# Altium schematic sheet RF_433MHz.SchDoc
size A3
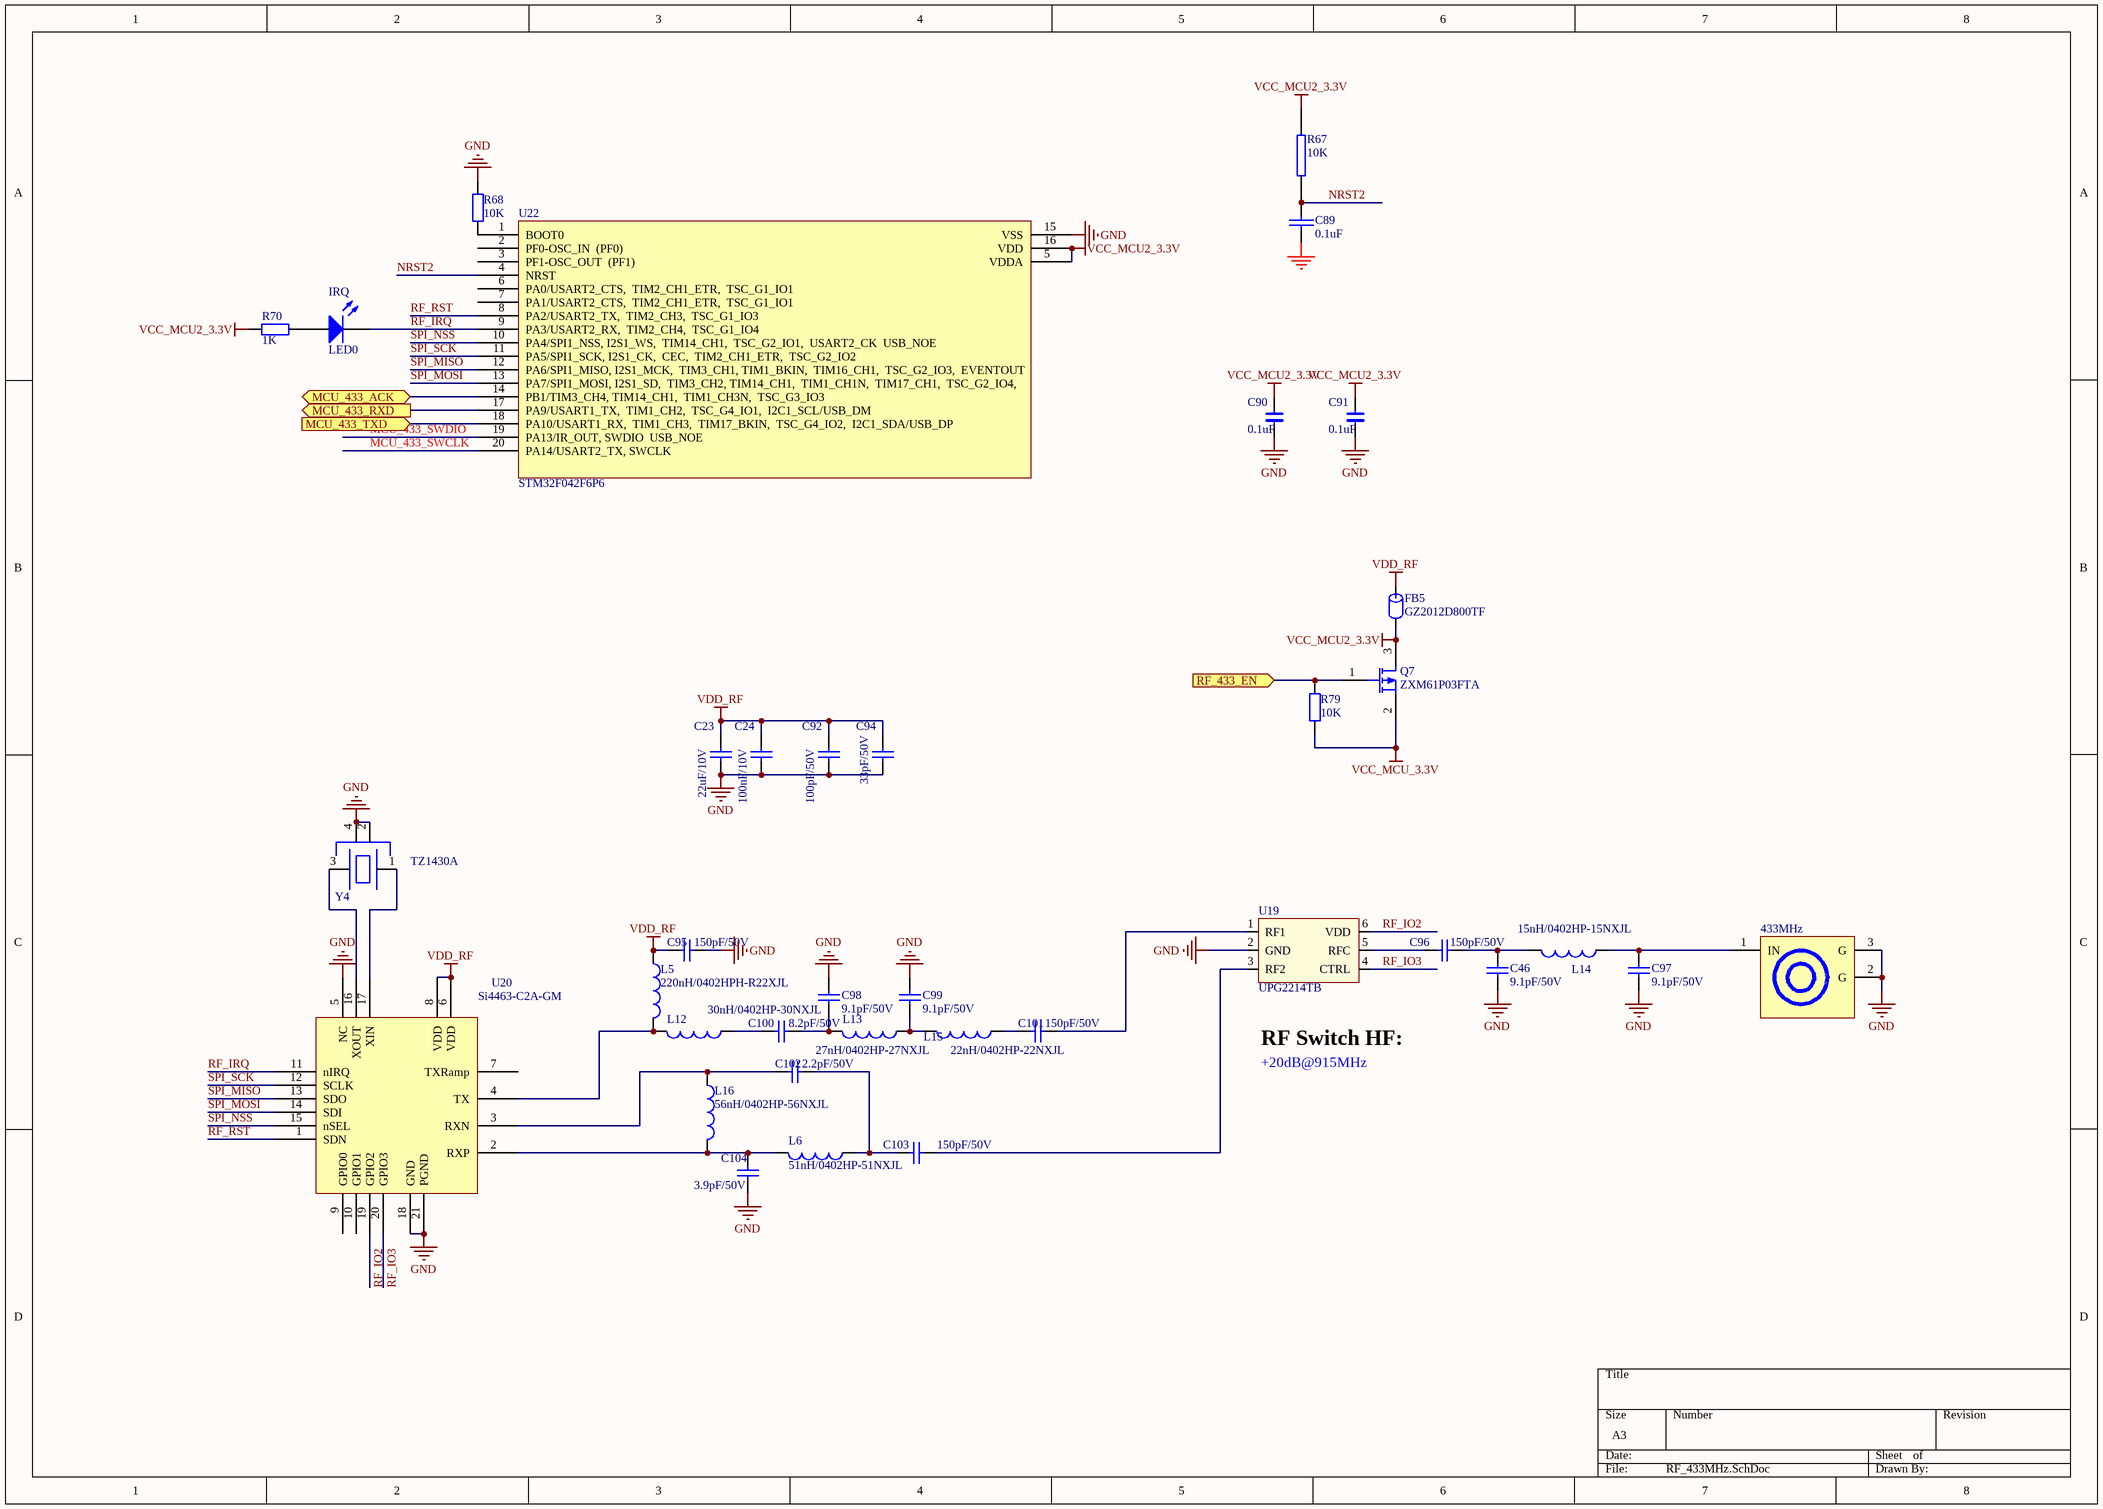
[diagram p0: RF_433MHz.SchDoc]

## Parts
433MHz  IPX  [ECT8180001581]  (value not drawn)
C23  22uF/10V  [0805C]
C24  100nF/10V  [0603C]
C46  9.1pF/50V  [0402C]
C89  0.1uF  [0603C]
C90  0.1uF  [0603C]
C91  0.1uF  [0603C]
C92  100pF/50V  [0603C]
C94  33pF/50V  [0603C]
C95  150pF/50V  [0402C]
C96  150pF/50V  [0402C]
C97  9.1pF/50V  [0402C]
C98  9.1pF/50V  [0402C]
C99  9.1pF/50V  [0402C]
C100  8.2pF/50V  [0402C]
C101  150pF/50V  [0402C]
C102  2.2pF/50V  [0402C]
C103  150pF/50V  [0402C]
C104  3.9pF/50V  [0402C]
FB5  GZ2012D800TF  [0805CZ]
IRQ  LED0  [0603LED]
L5  220nH/0402HPH-R22XJL  [0402R]
L6  51nH/0402HP-51NXJL  [0402R]
L12  30nH/0402HP-30NXJL  [0402R]
L13  27nH/0402HP-27NXJL  [0402R]
L14  15nH/0402HP-15NXJL  [0402R]
L15  22nH/0402HP-22NXJL  [0402R]
L16  56nH/0402HP-56NXJL  [0402R]
Q7  ZXM61P03FTA  [SOT23-3]
R67  10K  [0603R]
R68  10K  [0603R]
R70  1K  [0603R]
R79  10K  [0603R]
U19  UPG2214TB  [SC70-6]
U20  Si4463-C2A-GM  [QFN50P400X400X80-20N]
U22  STM32F042F6P6  [SOP65P640X265-20N]
Y4  TZ1430A  [OSCILLATOR-2.5X2.0]

## Ports
MCU_433_ACK (bidir), MCU_433_RXD (out), MCU_433_TXD (in), RF_433_EN (in)

## Nets
GND: 433MHz.2(G) 433MHz.3(G) C23.1 C24.1 C46.1 C89.2 C90.1 C91.1 C92.1 C94.1 C95.2 C97.1 C98.2 C99.2 C104.1 R68.2 U19.2(GND) U20.5(NC) U20.18(GND) U20.21(PGND) U22.15(VSS) Y4.2(GND) Y4.4(GND)
VCC_MCU2_3.3V: C90.2 C91.2 FB5.2 Q7.3(S) R67.1 R70.1 U22.5(VDDA) U22.16(VDD)
VCC_MCU_3.3V: Q7.2(D) R79.2
VDD_RF: C23.2 C24.2 C92.2 C94.2 C95.1 FB5.1 L5.1 U20.6(VDD) U20.8(VDD)
MCU_433_ACK: U22.14(PB1/TIM3_CH4,_TIM14_CH1,__TIM1_CH3N,__TSC_G3_IO3) ; port MCU_433_ACK
MCU_433_RXD: U22.17(PA9/USART1_TX,__TIM1_CH2,__TSC_G4_IO1,__I2C1_SCL/USB_DM) ; port MCU_433_RXD
MCU_433_SWCLK: U22.20(PA14/USART2_TX,_SWCLK)
MCU_433_SWDIO: U22.19(PA13/IR_OUT,_SWDIO__USB_NOE)
MCU_433_TXD: U22.18(PA10/USART1_RX,__TIM1_CH3,__TIM17_BKIN,__TSC_G4_IO2,__I2C1_SDA/USB_DP) ; port MCU_433_TXD
NRST2: C89.1 R67.2 U22.4(NRST)
RF_433_EN: Q7.1(G) R79.1 ; port RF_433_EN
RF_IO2: U19.6(VDD) U20.19(GPIO2)
RF_IO3: U19.4(CTRL) U20.20(GPIO3)
RF_IRQ: IRQ.2(K) U20.11(nIRQ) U22.9(PA3/USART2_RX,__TIM2_CH4,__TSC_G1_IO4)
RF_RST: U20.1(SDN) U22.8(PA2/USART2_TX,__TIM2_CH3,__TSC_G1_IO3)
SPI_MISO: U20.13(SDO) U22.12(PA6/SPI1_MISO,_I2S1_MCK,__TIM3_CH1,_TIM1_BKIN,__TIM16_CH1,__TSC_G2_IO3,__EVENTOUT)
SPI_MOSI: U20.14(SDI) U22.13(PA7/SPI1_MOSI,_I2S1_SD,__TIM3_CH2,_TIM14_CH1,__TIM1_CH1N,__TIM17_CH1,__TSC_G2_IO4,)
SPI_NSS: U20.15(nSEL) U22.10(PA4/SPI1_NSS,_I2S1_WS,__TIM14_CH1,__TSC_G2_IO1,__USART2_CK__USB_NOE)
SPI_SCK: U20.12(SCLK) U22.11(PA5/SPI1_SCK,_I2S1_CK,__CEC,__TIM2_CH1_ETR,__TSC_G2_IO2)
Net433MHz_1: 433MHz.1(IN) C97.2 L14.1
NetC46_2: C46.2 C96.1 L14.2
NetC96_2: C96.2 U19.5(RFC)
NetC98_1: C98.1 C100.2 L13.2
NetC99_1: C99.1 L13.1 L15.2
NetC100_1: C100.1 L12.1
NetC101_1: C101.1 U19.1(RF1)
NetC101_2: C101.2 L15.1
NetC102_1: C102.1 L16.1 U20.3(RXN)
NetC102_2: C102.2 C103.1 L6.1
NetC103_2: C103.2 U19.3(RF2)
NetC104_2: C104.2 L6.2 L16.2 U20.2(RXP)
NetIRQ_1: IRQ.1(A) R70.2
NetL5_2: L5.2 L12.2 U20.4(TX)
NetR68_1: R68.1 U22.1(BOOT0)
NetU20_16: U20.16(XOUT) Y4.3
NetU20_17: U20.17(XIN) Y4.1

Not connected (* = marked no-connect by the designer): U20 7(TXRamp) 9(GPIO0) 10(GPIO1); U22 2(PF0-OSC_IN__(PF0)) 3(PF1-OSC_OUT__(PF1)) 6(PA0/USART2_CTS,__TIM2_CH1_ETR,__TSC_G1_IO1) 7(PA1/USART2_CTS,__TIM2_CH1_ETR,__TSC_G1_IO1)

## Notes on the sheet
- RF Switch HF:
- +20dB@915MHz

## Library data of the parts
433MHz = IPX: MCU; ComponentLink1Description: 供应商链接; ComponentLink1URL: http://www.szlcsc.com/product/details_9202.html; Package: LQFP-44_10x10x08P; Supplier: LC; SuppliersPartNumber: C8696
C23 = Cap Semi: Capacitor (Semiconductor SIM Model); Value: 22uF; Published: 8-Jun-2000; LatestRevisionDate: 05-oct-2007  -  Semtech; LatestRevisionNote: Re-released for DXP Platform.; Publisher: Altium Limited
C24 C92 C94 = Cap Semi: Capacitor (Semiconductor SIM Model); Value: 1uF; Published: 8-Jun-2000; LatestRevisionDate: 05-oct-2007  -  Semtech; LatestRevisionNote: Re-released for DXP Platform.; Publisher: Altium Limited
C46 C97 = Cap: Capacitor SMD; Value: NC; Published: 8-Jun-2000; LatestRevisionDate: 05-oct-2007  -  Semtech; LatestRevisionNote: Re-released for DXP Platform.; Publisher: Altium Limited
C89 = CAP: Capacitor
C90 C91 = C
C95 C96 C98-C104 = Cap: Capacitor SMD; Value: 100nF; Published: 8-Jun-2000; LatestRevisionDate: 05-oct-2007  -  Semtech; LatestRevisionNote: Re-released for DXP Platform.; Publisher: Altium Limited
FB5 = FB: Part Field 1: 磁珠/0603/1K ohm/100MHz; FB: BLM18BD102SN1(muRata); Text Field1: FB
IRQ = LED0: Typical INFRARED GaAs LED; Published: 8-Jun-2000; LatestRevisionDate: 08-Jul-2005; LatestRevisionNote: Mech Layer 1 removed.; PackageReference: LED-0; Publisher: Altium Limited
L5 L6 L13 L15 L16 = Inductor: Inductor SMD; Code_IEC: 1005; Value: VAL?; Published: 8-Jun-2000; LatestRevisionDate: 05-oct-2007  -  Semtech; LatestRevisionNote: Re-released for DXP Platform.; Publisher: Altium Limited; Code_JEITA: 0402
L12 = Inductor: Inductor SMD; Code_IEC: 1005; Value: 870mA; Published: 8-Jun-2000; LatestRevisionDate: 05-oct-2007  -  Semtech; LatestRevisionNote: Re-released for DXP Platform.; Publisher: Altium Limited; Code_JEITA: 0402
L14 = Inductor: Inductor SMD; Code_IEC: 1005; Value: 0R; Published: 8-Jun-2000; LatestRevisionDate: 05-oct-2007  -  Semtech; LatestRevisionNote: Re-released for DXP Platform.; Publisher: Altium Limited; Code_JEITA: 0402
Q7 = MOSFET-P: ZXM61P03F; Published: 8-Jun-2000; LatestRevisionDate: 17-Jul-2002; LatestRevisionNote: Re-released for DXP Platform.; PackageVersion: 1995/1996; PackageReference: E3; Publisher: Altium Limited
R67 = RES2
R68 R70 = Res2: Resistor; Published: 8-Jun-2000; LatestRevisionDate: 17-Jul-2002; LatestRevisionNote: Re-released for DXP Platform.; PackageReference: AXIAL-0.4; Publisher: Altium Limited
  R68: Value: 10K
  R70: Value: 1K
R79 = Res2: Resistor; Value: 1K; Published: 8-Jun-2000; LatestRevisionDate: 17-Jul-2002; LatestRevisionNote: Re-released for DXP Platform.; PackageReference: AXIAL-0.4; Publisher: Altium Limited
U19 = PE4259 RF Switch: PE4259 Peregrine RF Switch; LatestRevisionDate: 03-Sep-2012 -  Semtech; Value: PE4259
U20 = Si4463
Y4 = XTAL3